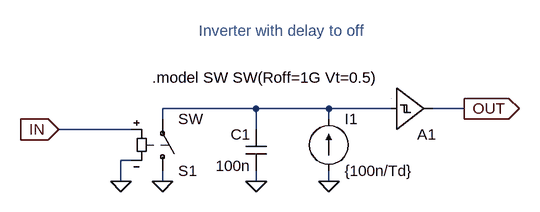
[diagram p0: schematic DelayOff.asc]
DelayOff.asc, the LTspice schematic file:
Version 4
SHEET 1 880 680
WIRE 160 80 16 80
WIRE 272 80 160 80
WIRE 368 80 272 80
WIRE 480 80 432 80
WIRE 16 96 16 80
WIRE 272 96 272 80
WIRE -32 112 -144 112
WIRE 160 112 160 80
WIRE -32 160 -48 160
WIRE -48 192 -48 160
WIRE 16 192 16 176
WIRE 160 192 160 176
WIRE 272 192 272 176
FLAG 272 192 0
FLAG 160 192 0
FLAG 16 192 0
FLAG -48 192 0
FLAG -144 112 IN
IOPIN -144 112 In
FLAG 480 80 OUT
IOPIN 480 80 Out
SYMBOL current 272 176 M180
WINDOW 0 24 80 Left 2
WINDOW 3 24 0 Left 2
WINDOW 123 0 0 Left 0
WINDOW 39 0 0 Left 0
SYMATTR InstName I1
SYMATTR Value {100n/Td}
SYMBOL cap 176 112 M0
SYMATTR InstName C1
SYMATTR Value 100n
SYMATTR SpiceLine Rpar=100Meg
SYMBOL sw 16 192 M180
SYMATTR InstName S1
SYMBOL Digital\\schmtbuf 368 144 M180
WINDOW 3 8 60 Invisible 2
SYMATTR Value VT=1 Vh=0.1
SYMATTR InstName A1
TEXT 0 32 Left 2 !.model SW SW(Roff=1G Vt=0.5)
TEXT 72 -40 Left 2 ;Inverter with delay to off

The netlist it stands for:
* DelayOff.asc
I1 0 N001 {100n/Td}
C1 N001 0 100n Rpar=100Meg
S1 0 N001 IN 0 SW
A1 N001 0 0 0 0 0 OUT 0 SCHMITT VT=1 Vh=0.1
.model SW SW(Roff=1G Vt=0.5)
* Inverter with delay to off
.backanno
.end